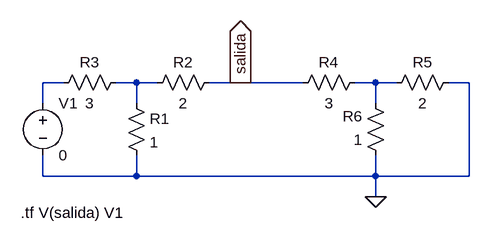
[diagram p0: schematic g2_p6.asc]
g2_p6.asc, the LTspice schematic file:
Version 4
SHEET 1 880 680
WIRE 0 112 -32 112
WIRE 112 112 80 112
WIRE 144 112 112 112
WIRE 272 112 224 112
WIRE 368 112 272 112
WIRE 480 112 448 112
WIRE 512 112 480 112
WIRE 624 112 592 112
WIRE -32 144 -32 112
WIRE 112 144 112 112
WIRE 480 144 480 112
WIRE -32 256 -32 224
WIRE 112 256 112 224
WIRE 112 256 -32 256
WIRE 480 256 480 224
WIRE 480 256 112 256
WIRE 624 256 624 112
WIRE 624 256 480 256
WIRE 480 288 480 256
FLAG 480 288 0
FLAG 272 112 salida
IOPIN 272 112 Out
SYMBOL res 96 128 R0
SYMATTR InstName R1
SYMATTR Value 1
SYMBOL res 240 96 R90
WINDOW 0 0 56 VBottom 2
WINDOW 3 32 56 VTop 2
SYMATTR InstName R2
SYMATTR Value 2
SYMBOL res 96 96 R90
WINDOW 0 0 56 VBottom 2
WINDOW 3 32 56 VTop 2
SYMATTR InstName R3
SYMATTR Value 3
SYMBOL res 464 96 R90
WINDOW 0 0 56 VBottom 2
WINDOW 3 32 56 VTop 2
SYMATTR InstName R4
SYMATTR Value 3
SYMBOL res 608 96 R90
WINDOW 0 0 56 VBottom 2
WINDOW 3 32 56 VTop 2
SYMATTR InstName R5
SYMATTR Value 2
SYMBOL res 496 240 R180
WINDOW 0 36 76 Left 2
WINDOW 3 36 40 Left 2
SYMATTR InstName R6
SYMATTR Value 1
SYMBOL voltage -32 128 R0
WINDOW 123 0 0 Left 0
WINDOW 39 0 0 Left 0
SYMATTR InstName V1
SYMATTR Value 0
TEXT -66 312 Left 2 !.tf V(salida) V1

The netlist it stands for:
* g2_p6.asc
R1 N002 0 1
R2 salida N002 2
R3 N002 N001 3
R4 N003 salida 3
R5 0 N003 2
R6 0 N003 1
V1 N001 0 0
.tf V(salida) V1
.backanno
.end